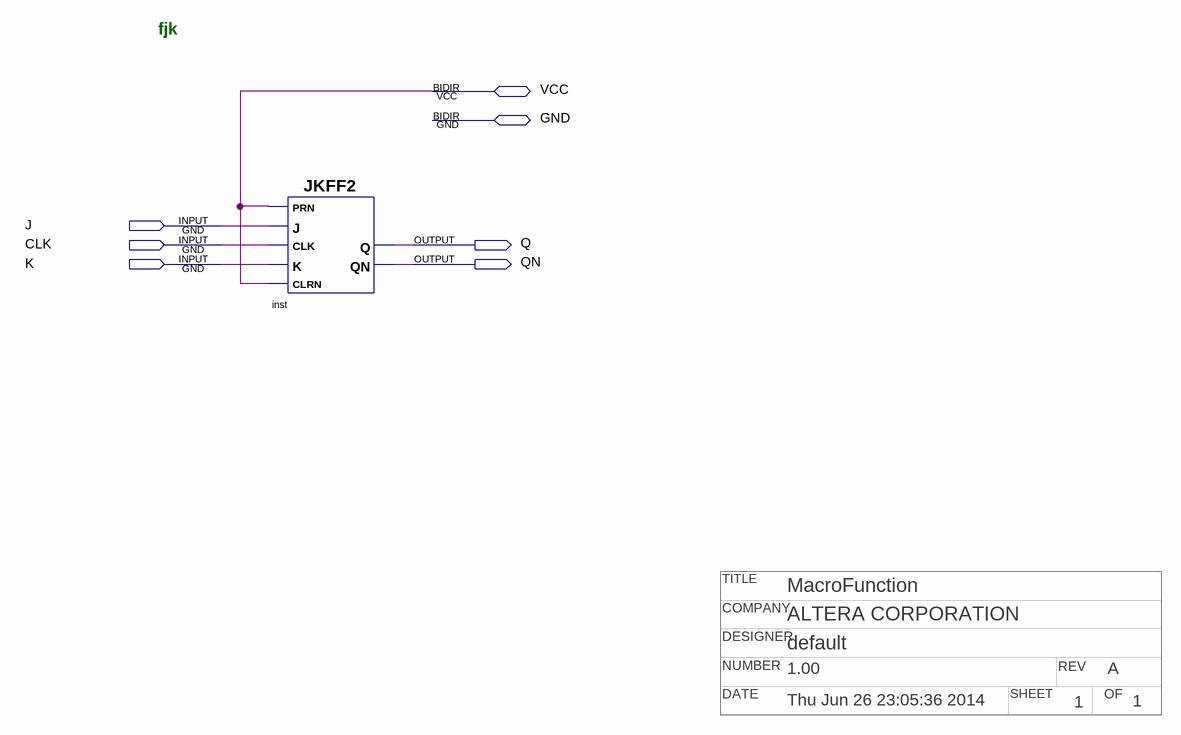
[diagram p0: schematic sheet]
// Quartus schematic npfjk.bdf as structural Verilog: 1 symbols, 7 pins
// Title block: TITLE: MacroFunction; COMPANY: ALTERA CORPORATION; DESIGNER: default; NUMBER: 1.00; REV: A; DATE: Thu Jun 26 23:05:36 2014; SHEET: 1; OF: 1
module npfjk (
  input  J,
  input  CLK,
  input  K,
  inout  VCC,
  inout  GND,
  output Q,
  output QN
);

  JKFF2 inst (.K(K), .CLRN(VCC), .CLK(CLK), .PRN(VCC), .J(J), .QN(QN), .Q(Q));

  // Notes on the sheet:
  //   fjk
endmodule
